# EAGLE design ir_upgrade (EAGLE 9.3.2)
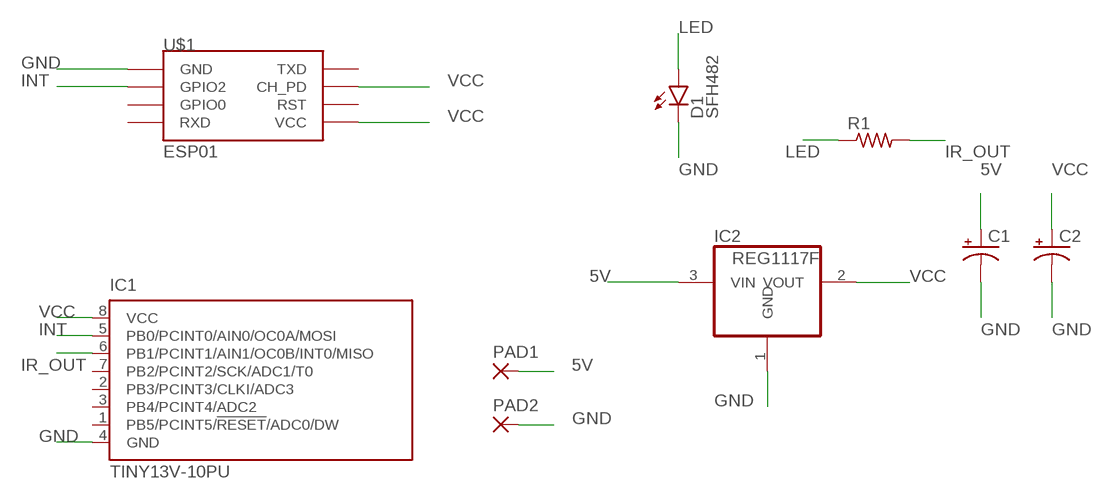
[diagram p0: schematic, sheet 1]

## Parts
C1  CPOL-USTT5D7  [TT5D7]
C2  CPOL-USTT5D7  [TT5D7]
D1  SFH482  [SFH482]
IC1  TINY13V-10PU  [DIL08]
IC2  REG1117F  [DD-3]
PAD1  2,15/1,0  [2,15/1,0]
PAD2  2,15/1,0  [2,15/1,0]
R1  R-US_VMTA55  [VMTA55]
U$1  ESP01  [ESP01]

## Nets
5V: C1.+ IC2.3(VIN) PAD1.1(P)
GND: C1.- C2.- D1.K(C) IC1.4(GND) IC2.1(GND) PAD2.1(P) U$1.GND
INT: IC1.5(PB0/PCINT0/AIN0/OC0A/MOSI) U$1.GPIO2
IR_OUT: IC1.6(PB1/PCINT1/AIN1/OC0B/INT0/MISO) R1.2
LED: D1.A R1.1
VCC: C2.+ IC1.8(VCC) IC2.2(VOUT) U$1.CH_PD U$1.VCC
Unconnected: IC1.1(PB5/PCINT5/!RESET!/ADC0/DW) IC1.2(PB3/PCINT3/CLKI/ADC3) IC1.3(PB4/PCINT4/ADC2) IC1.7(PB2/PCINT2/SCK/ADC1/T0) U$1.GPIO0 U$1.RST U$1.RX(RXD) U$1.TX(TXD)

## Library data of the parts
C1 C2 = rcl:CPOL-US: POLARIZED CAPACITOR, American symbol; SPICEPREFIX: C
D1 = led:SFH482: IR LED infrared emitting diode, Infineon
IC1 = atmel:TINY13: 8-bit AVR Microcontroller with 1K Bytes In-System Programmable Flash Source: http://www.atmel.com/dyn/resources/prod_documents/2535S.pdf; MPN: ATTINY13V-10PU; OC_FARNELL: 9171576; OC_NEWARK: 96K6523
IC2 = burr-brown:REG1117: 800mA and 1A Low Dropout (LDO) Positive Regulator 1.8V, 2.5V, 2.85V, 3.3V, 5V, and Adj; MF: TEXAS INSTRUMENTS; MPN: REG1117FAKTTT; OC_FARNELL: 1296120; OC_NEWARK: 87H2562
PAD1 PAD2 = wirepad:2,15/1,0: THROUGH-HOLE PAD
R1 = rcl:R-US_: RESISTOR, American symbol; SPICEPREFIX: R
U$1 = esp8266modules:ESP01: ESP8266 Wifi module 01

## Board
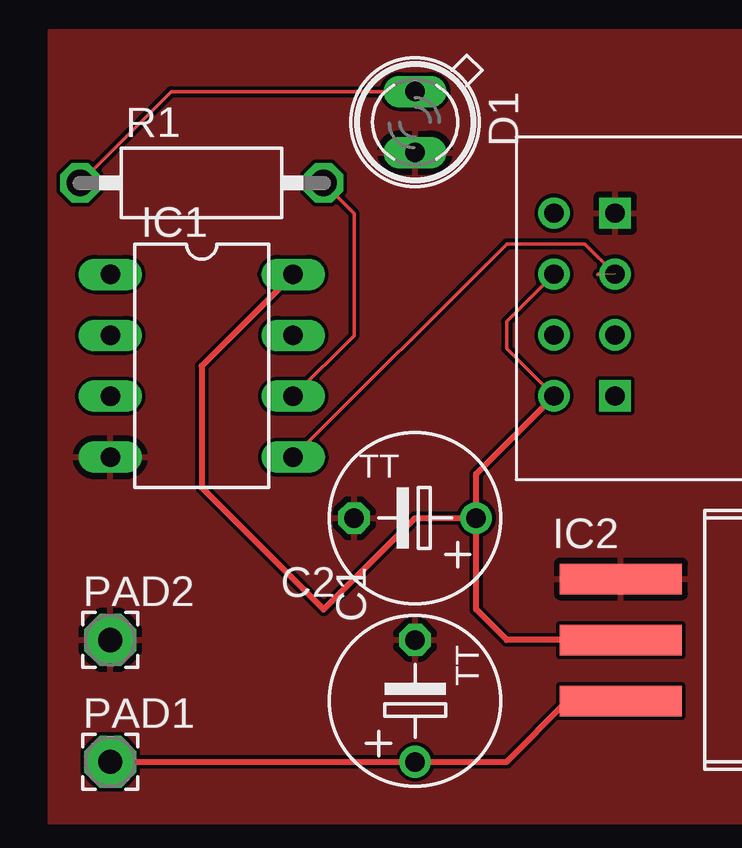
[diagram p1: board, top side]

No outline drawn. Coordinates in mm, seen from the top.
Copper layers (1*16): Top 0.035mm / dielectric 1.5mm / Bottom 0.035mm
Design rules "default": minimum track width 6mil, minimum drill 0.35mm, track to track 6mil, track to pad 6mil, pad to pad 6mil, via to via 6mil, smd to smd 6mil, copper to edge 40mil, drill to drill 6mil, minimum pad ring 10mil, minimum via ring 8mil, stop-mask expansion 4mil, vias tented up to drill 0mil, thermal gap 10mil

### Footprints (pad centres in the part's own frame; a part is rotated, then mirrored left to right if it is on the bottom)
TT5D7 = drill 0.813: + -2.54,0 | drill 0.813 octagon: - 2.54,0
SFH482 = drill 0.813 long: A -1.27,0; K 1.27,0
DIL08 = drill 0.813 long: 1 -3.81,-3.81; 2 -1.27,-3.81; 3 1.27,-3.81; 4 3.81,-3.81; 5 3.81,3.81; 6 1.27,3.81; 7 -1.27,3.81; 8 -3.81,3.81
DD-3 = smd 1.27 x 5.08: 1 -2.54,-7.938; 2 0,-7.938; 3 2.54,-7.938
2,15/1,0 = drill 1.016 pad 2.159 octagon: 1 0,0
VMTA55 = drill 1.1 octagon: 1 -5.08,0; 2 5.08,0
ESP01 = drill 0.8: CH_PD -1.285,-8.178; GPIO0 1.255,-5.638; GPIO2 -1.285,-5.638; RST 1.255,-8.178; TX -3.825,-8.178; VCC 3.795,-8.178 | drill 0.8 square: GND -3.825,-5.638; RX 3.795,-5.638

### Placement (x,y rotation side)
C1  17.78,7.62 90 top
C2  17.78,15.24 180 top
D1  17.78,31.75 270 top
IC1  8.89,21.59 270 top
IC2  34.29,10.16 270 top
PAD1  5.08,5.08 0 top
PAD2  5.08,10.16 0 top
R1  8.89,29.21 0 top
U$1  31.75,24.13 270 top

### Tracks (layer width: path | path; a pad name or v marks a point on that pad's centre or on a via)
5V
  Top 0.254: PAD1.1 C1.+ 21.59,5.08 24.13,7.62 IC2.3
GND
  pour Top: 2.54,35.56 48.26,35.56 48.26,2.54 2.54,2.54
INT  (1 unrouted)
  Top 0.152: 13.97,17.78 IC1.5 21.59,26.67 24.86,26.67 U$1.GPIO2 | 25.4,25.4 25.41,25.41
IR_OUT
  Top 0.152: IC1.6 15.24,22.86 15.24,27.94 R1.2
LED
  Top 0.152: R1.1 7.62,33.02 D1.A
VCC
  Top 0.152: IC2.2 26.35,10.48 | U$1.CH_PD 21.59,23.43 21.59,22.32 U$1.VCC | 11.43,25.4 IC1.8
  Top 0.254: IC2.2 21.59,10.16 20.32,11.43 C2.+ | C2.+ 20.32,17.08 U$1.VCC | IC1.8 8.89,21.59 8.89,16.51 13.97,11.43 17.78,15.24 C2.+